# EAGLE design Central_march16 (EAGLE 7.6.0)
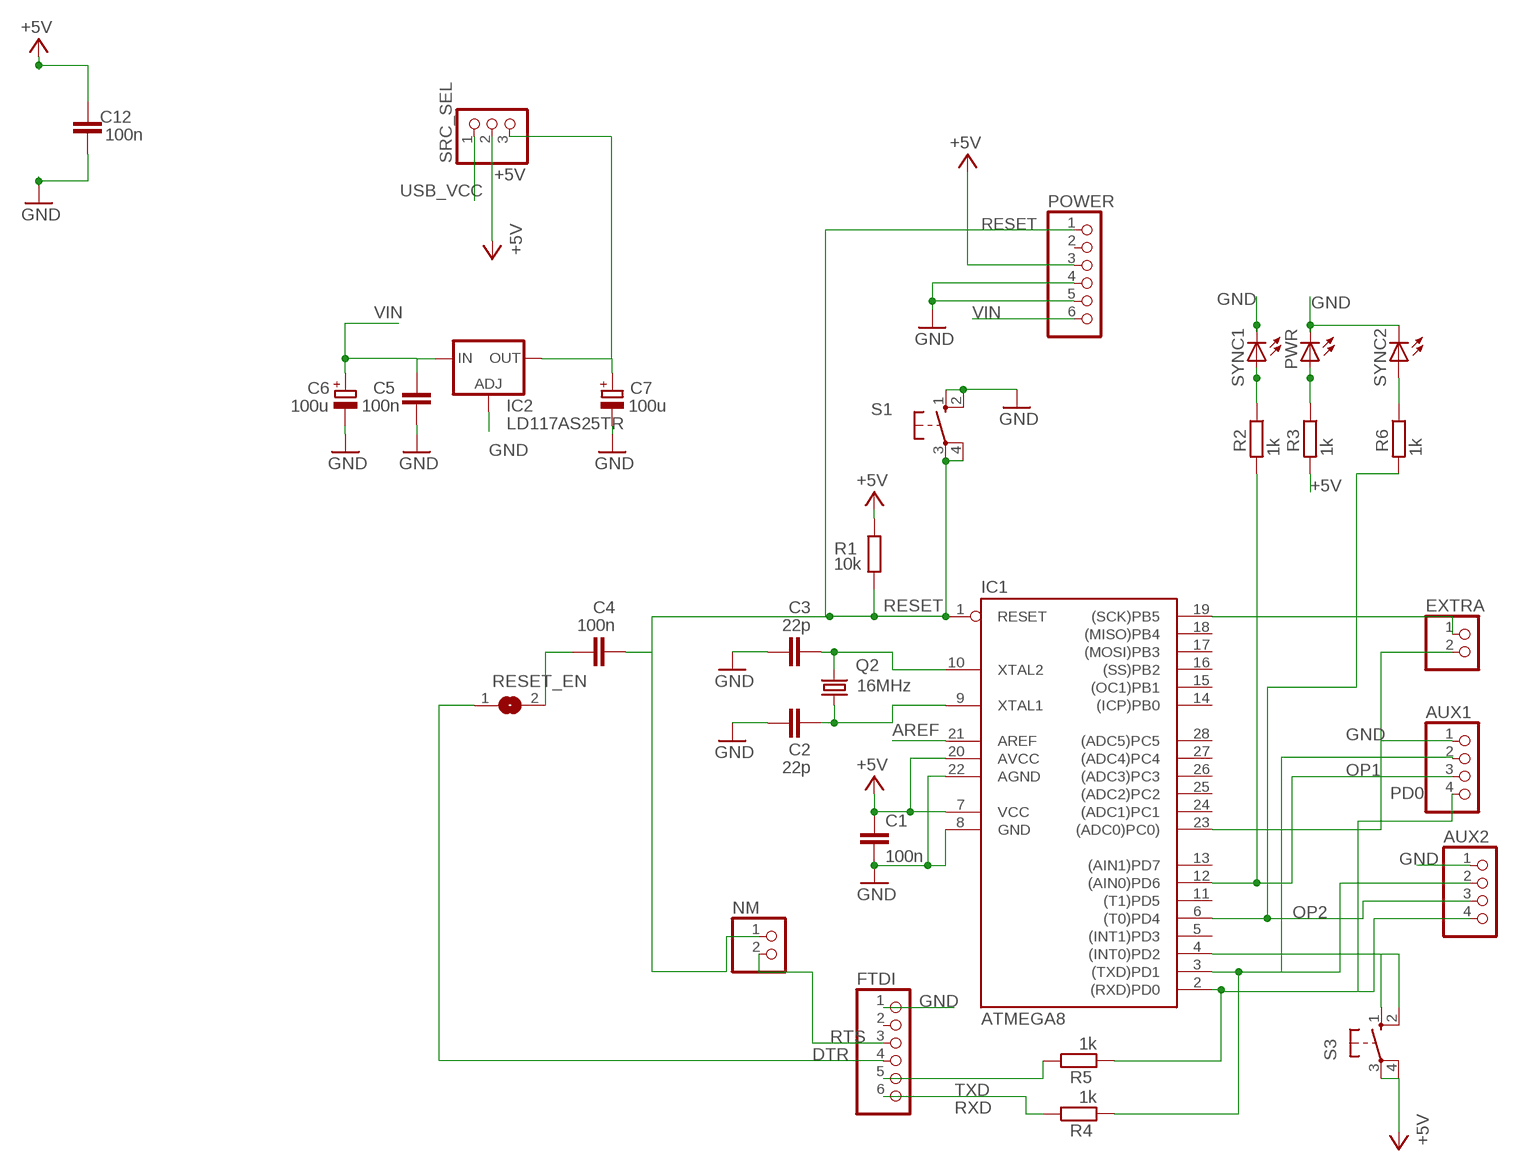
[diagram p0: schematic, sheet 1]

## Parts
AUX1  PINHD-1X4  [1X04]
AUX2  PINHD-1X4  [1X04]
C1  100n  C-EUC1206  [C1206]
C2  22p  C-EUC1206  [C1206]
C3  22p  C-EUC1206  [C1206]
C4  100n  C-EUC1206  [C1206]
C5  100n  C-EUC1206  [C1206]
C6  100u  CPOL-EUD  [PANASONIC_D]
C7  100u  CPOL-EUD  [PANASONIC_D]
C12  100n  C-EUC1206  [C1206]
EXTRA  PINHD-1X2  [1X02]
FTDI  PINHD-1X6  [1X06]
IC1  ATMEGA8  AT90S4433P  [DIL28-3]
IC2  LD117AS25TR  [SOT223]
NM  PINHD-1X2  [1X02]
POWER  PINHD-1X6  [1X06]
PWR  LEDCHIPLED_1206  [CHIPLED_1206]
Q2  16MHz  CRYTALHC49S  [HC49/S]
R1  10k  R-EU_R1206  [R1206]
R2  1k  R-EU_R1206  [R1206]
R3  1k  R-EU_R1206  [R1206]
R4  1k  R-EU_R1206  [R1206]
R5  1k  R-EU_R1206  [R1206]
R6  1k  R-EU_R1206  [R1206]
RESET_EN  SJ  [SJ]
S1  10-XX  [B3F-10XX]
S3  10-XX  [B3F-10XX]
SRC_SEL  PINHD-1X3  [1X03]
SYNC1  LEDCHIPLED_1206  [CHIPLED_1206]
SYNC2  LEDCHIPLED_1206  [CHIPLED_1206]

## Nets
+5V [usbvcc]: C1.1 C12.2 IC1.7(VCC) IC1.20(AVCC) POWER.3 R1.2 R3.2 S3.3(P) S3.4(P1) SRC_SEL.2
AREF [aref]: IC1.21(AREF)
DTR: FTDI.4 RESET_EN.1
GND [gnd]: AUX1.1 AUX2.1 C1.2 C2.1 C3.1 C5.1 C6.- C7.- C12.1 FTDI.1 IC1.8(GND) IC1.22(AGND) IC2.1(ADJ) POWER.4 POWER.5 PWR.C S1.1(S) S1.2(S1) SYNC1.C SYNC2.C
N$1: R6.1 SYNC2.A
N$2: EXTRA.2 IC1.23((ADC0)PC0))
N$3: R2.1 SYNC1.A
N$4: PWR.A R3.1
N$5: IC1.4((INT0)PD2) S3.1(S) S3.2(S1)
N$6: C2.2 IC1.9(XTAL1) Q2.1
N$7: C3.2 IC1.10(XTAL2) Q2.2
N$8: C4.1 RESET_EN.2
N$9: EXTRA.1 IC1.19((SCK)PB5)
N$10: AUX1.2 AUX2.2 IC1.3((TXD)PD1) R4.2
OP1: AUX1.3 IC1.12((AIN0)PD6) R2.2
OP2: AUX2.3 IC1.6((T0)PD4) R6.2
PD0: AUX1.4 AUX2.4 IC1.2((RXD)PD0) R5.2
RESET: C4.2 IC1.1(RESET) NM.1 POWER.1 R1.1 S1.3(P) S1.4(P1)
RTS: FTDI.3 NM.2
RXD: FTDI.6 R4.1
TXD: FTDI.5 R5.1
USB_VCC: SRC_SEL.1
VIN [power]: C5.2 C6.+ IC2.3(IN) POWER.6
VIN_REG [usbvcc]: C7.+ IC2.4(OUT) SRC_SEL.3
Unconnected: FTDI.2 IC1.5((INT1)PD3) IC1.11((T1)PD5) IC1.13((AIN1)PD7) IC1.14((ICP)PB0) IC1.15((OC1)PB1) IC1.16((SS)PB2) IC1.17((MOSI)PB3) IC1.18((MISO)PB4) IC1.24((ADC1)PC1) IC1.25((ADC2)PC2) IC1.26((ADC3)PC3) IC1.27((ADC4)PC4) IC1.28((ADC5)PC5) POWER.2

## Library data of the parts
AUX1 AUX2 = pinhead:PINHD-1X4: PIN HEADER
C1-C5 C12 = rcl:C-EU: CAPACITOR, European symbol
C6 C7 = rcl:CPOL-EU: POLARIZED CAPACITOR, European symbol
EXTRA NM = pinhead:PINHD-1X2: PIN HEADER
FTDI POWER = pinhead:PINHD-1X6: PIN HEADER
IC1 = atmel:AT90S4433: MICROCONTROLLER 4 Kbytes FLASH 128 bytes SRAM 256 bytes EEPROM UART 6-channel 10 bit ADC
IC2 = v-reg:LD117A?*: Low drop fixed and adjustable positive voltage regulators 1 A Source: http://www.st.com/stonline/products/literature/ds/7194/ld1117axx.pdf
PWR SYNC1 SYNC2 = led:LED: LED OSRAM: - CHIPLED LG R971, LG N971, LY N971, LG Q971, LY Q971, LO R971, LY R971 LH N974, LH R974 LS Q976, LO Q976, LY Q976 LO Q996 - Hyper CHIPLED LW Q18S LB Q993, LB Q99A, LB R99A - SideLED LS A670, LO A670, LY A670, LG A670, LP A670 LB A673, LV A673, LT A673, LW A673 LH A674 LY A675 LS A676, LA A676, LO A676, LY A676, LW A676 LS A679, LY A679, LG A679 - Hyper Micro SIDELED® LS Y876, LA Y876, LO Y876, LY Y876 LT Y87S - SmartLED LW L88C, LW L88S LB L89C, LB L89S, LG L890 LS L89K, LO L89K, LY L89K LS L896, LA L896, LO L896, LY L896 - TOPLED LS T670, LO T670, LY T670, LG T670, LP T670 LSG T670, LSP T670, LSY T670, LOP T670, LYG T670 LG T671, LOG T671, LSG T671 LB T673, LV T673, LT T673, LW T673 LH T674 LS T676, LA T676, LO T676, LY T676, LB T676, LH T676, LSB T676, LW T676 LB T67C, LV T67C, LT T67C, LS T67K, LO T67K, LY T67K, LW E67C LS E67B, LA E67B, LO E67B, LY E67B, LB E67C, LV E67C, LT E67C LW T67C LS T679, LY T679, LG T679 LS T770, LO T770, LY T770, LG T770, LP T770 LB T773, LV T773, LT T773, LW T773 LH T774 LS E675, LA E675, LY E675, LS T675 LS T776, LA T776, LO T776, LY T776, LB T776 LHGB T686 LT T68C, LB T68C - Hyper Mini TOPLED® LB M676 - Mini TOPLED Santana® LG M470 LS M47K, LO M47K, LY M47K Source: http://www.osram.convergy.de LUXEON: - LUMILED® LXK2-PW12-R00, LXK2-PW12-S00, LXK2-PW14-U00, LXK2-PW14-V00 LXK2-PM12-R00, LXK2-PM12-S00, LXK2-PM14-U00 LXK2-PE12-Q00, LXK2-PE12-R00, LXK2-PE12-S00, LXK2-PE14-T00, LXK2-PE14-U00 LXK2-PB12-K00, LXK2-PB12-L00, LXK2-PB12-M00, LXK2-PB14-N00, LXK2-PB14-P00, LXK2-PB14-Q00 LXK2-PR12-L00, LXK2-PR12-M00, LXK2-PR14-Q00, LXK2-PR14-R00 LXK2-PD12-Q00, LXK2-PD12-R00, LXK2-PD12-S00 LXK2-PH12-R00, LXK2-PH12-S00 LXK2-PL12-P00, LXK2-PL12-Q00, LXK2-PL12-R00 Source: www.luxeon.com KINGBRIGHT: KA-3528ASYC Source: www.kingbright.com
Q2 = crystal:CRYTAL: CRYSTAL
R1-R6 = rcl:R-EU_: RESISTOR, European symbol
RESET_EN = jumper:SJ: SMD solder JUMPER
S1 S3 = switch-omron:10-XX: OMRON SWITCH; MPN: B3F-1000; OC_FARNELL: 176432; OC_NEWARK: 36M3542
SRC_SEL = pinhead:PINHD-1X3: PIN HEADER

## Net classes
0 default: width 0.254 mm, drill 0.305 mm, clearance 0.152 mm
1 power: width 0.61 mm, drill 0.508 mm, clearance 0.152 mm
2 gnd: width 0.305 mm, drill 0.508 mm, clearance 0.152 mm
3 usbvcc: width 0.508 mm, drill 0.508 mm, clearance 0.152 mm
4 aref: width 0.406 mm

## Board
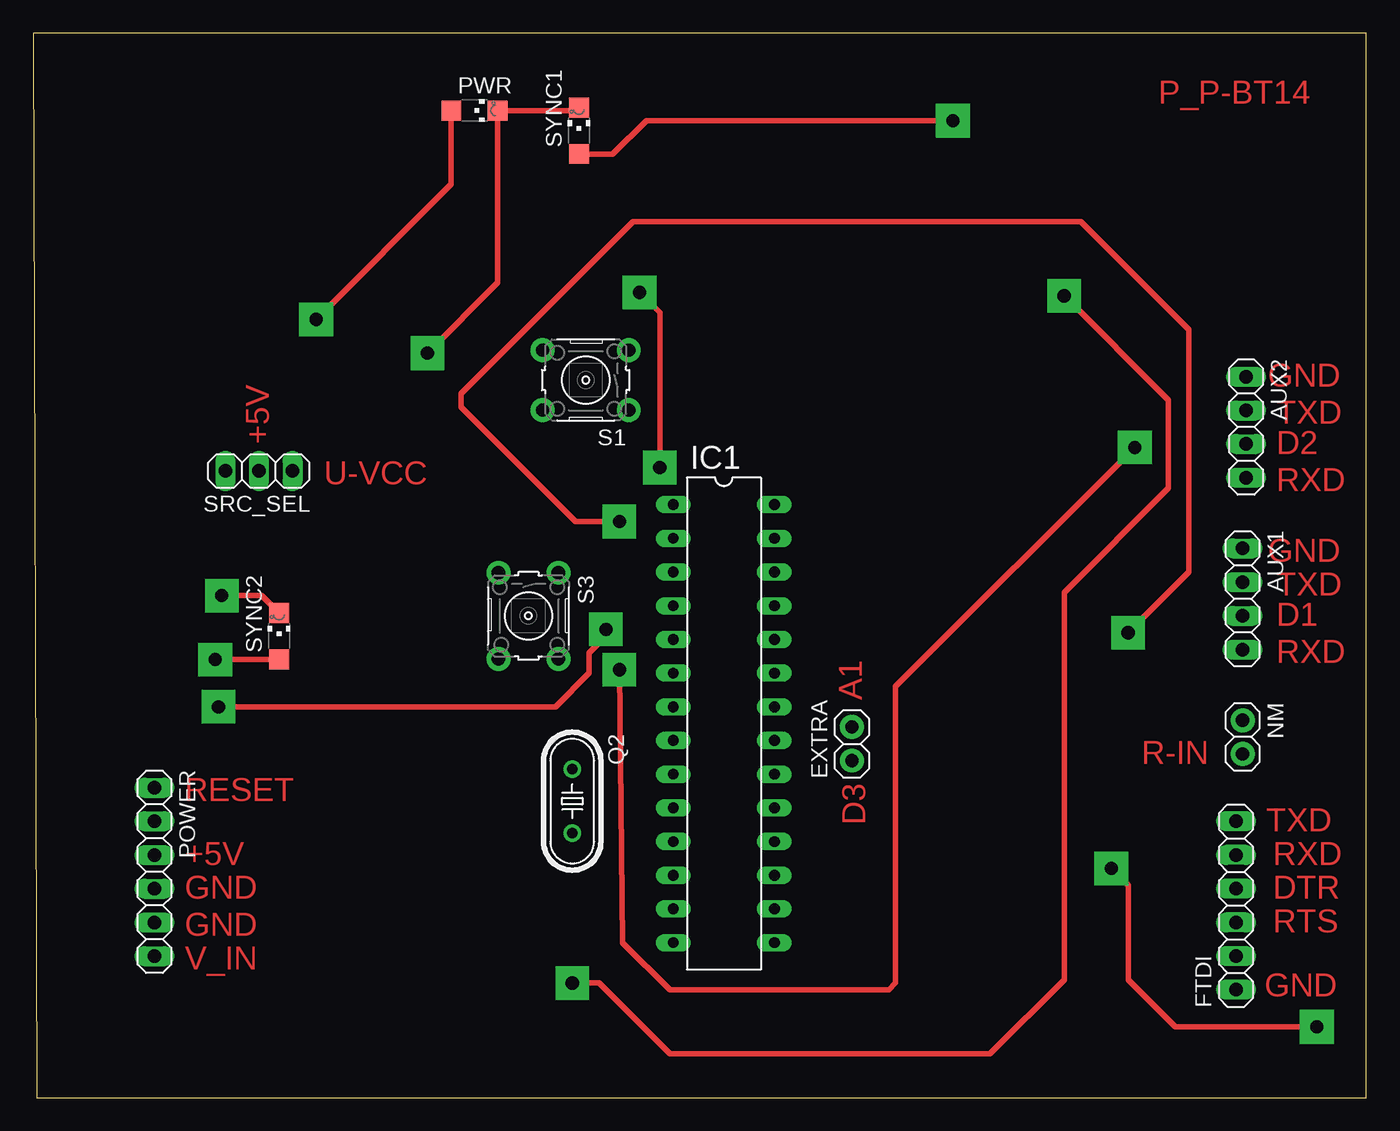
[diagram p1: board, top side]
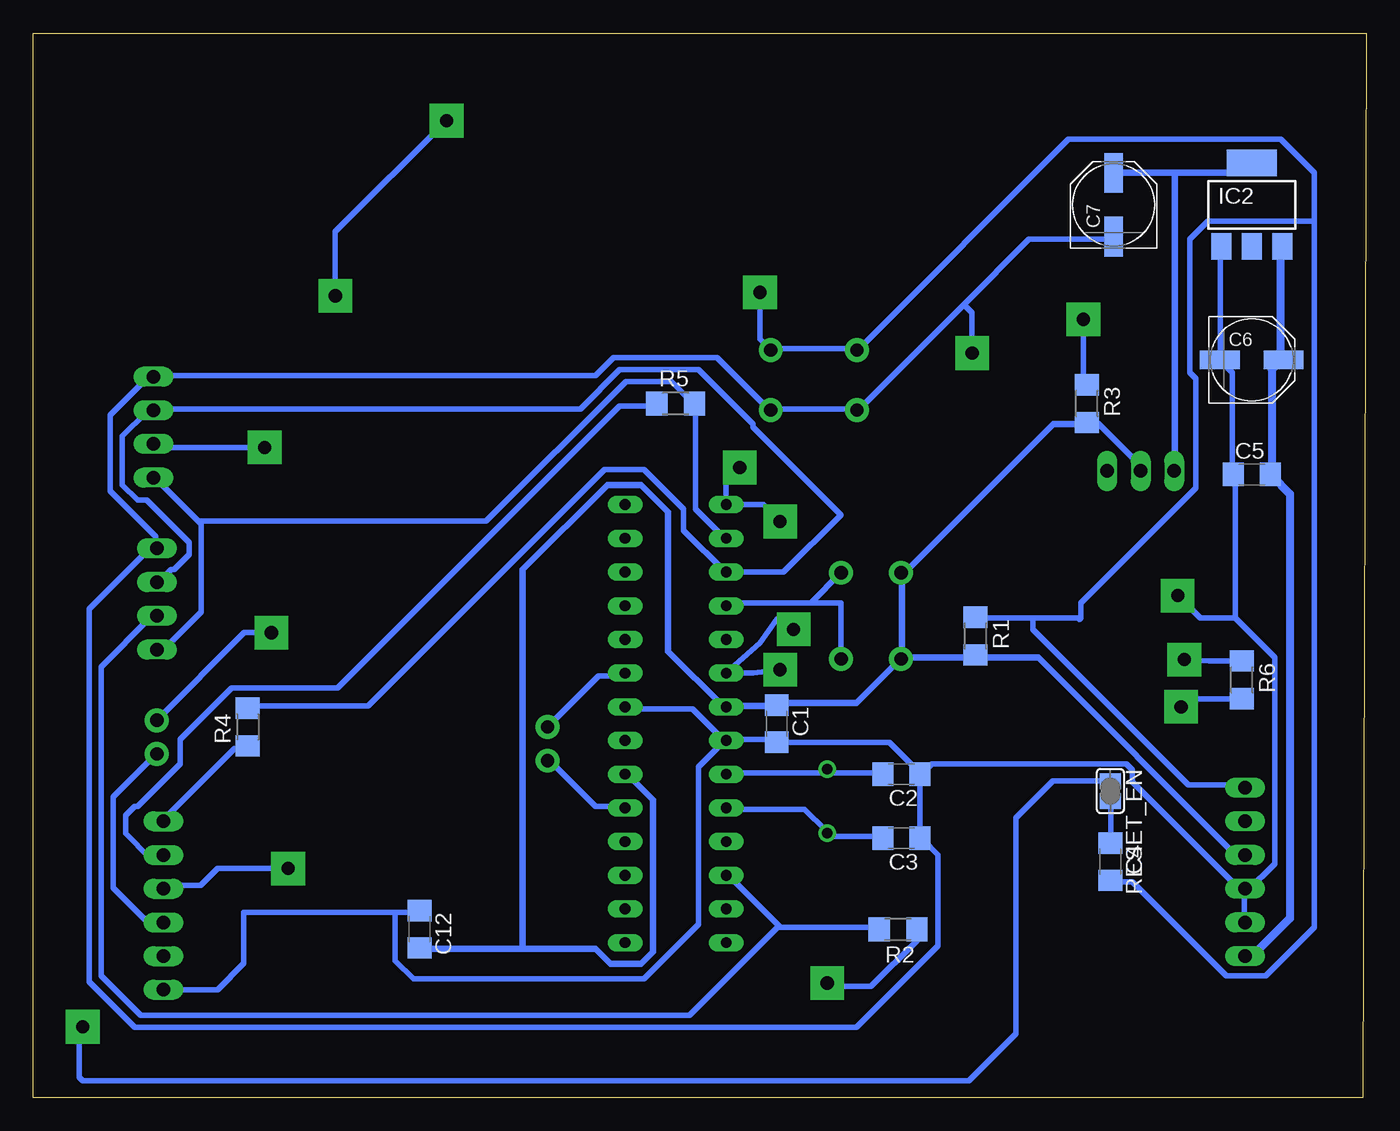
[diagram p2: board, bottom side, seen from below]

Size 100.51 x 80.25 mm. Coordinates in mm from the lower left corner, seen from the top.
Outline: 0.25,0 100.51,0 100.51,80.25 0,80.25 0.25,0
Copper layers (1*16): Top 0.035mm / dielectric 1.5mm / Bottom 0.035mm
Design rules "default *": minimum track width 16mil, minimum drill 24mil, track to track 20mil, track to pad 20mil, pad to pad 20mil, via to via 20mil, smd to smd 20mil, copper to edge 40mil, drill to drill 8mil, minimum pad ring 10mil, minimum via ring 8mil, stop-mask expansion 4mil, vias tented up to drill 0mil, thermal gap 10mil

### Footprints (pad centres in the part's own frame; a part is rotated, then mirrored left to right if it is on the bottom)
1X04 = drill 1.016 long: 1 -3.81,0; 2 -1.27,0; 3 1.27,0; 4 3.81,0
C1206 = smd 1.6 x 1.8: 1 -1.4,0; 2 1.4,0
PANASONIC_D = smd 3 x 1.4: + 2.4,0; - -2.4,0
1X02 = drill 1 pad 1.8: 1 -1.27,0; 2 1.27,0
1X06 = drill 1.016 long: 1 -6.35,0; 2 -3.81,0; 3 -1.27,0; 4 1.27,0; 5 3.81,0; 6 6.35,0
DIL28-3 = drill 0.813 long: 1 -16.51,-3.81; 2 -13.97,-3.81; 3 -11.43,-3.81; 4 -8.89,-3.81; 5 -6.35,-3.81; 6 -3.81,-3.81; 7 -1.27,-3.81; 8 1.27,-3.81; 9 3.81,-3.81; 10 6.35,-3.81; 11 8.89,-3.81; 12 11.43,-3.81; 13 13.97,-3.81; 14 16.51,-3.81; 15 16.51,3.81; 16 13.97,3.81; 17 11.43,3.81; 18 8.89,3.81; 19 6.35,3.81; 20 3.81,3.81; 21 1.27,3.81; 22 -1.27,3.81; 23 -3.81,3.81; 24 -6.35,3.81; 25 -8.89,3.81; 26 -11.43,3.81; 27 -13.97,3.81; 28 -16.51,3.81
SOT223 = smd 1.5 x 2: 1 -2.3,-3.15; 2 0,-3.15; 3 2.3,-3.15 | smd 3.8 x 2: 4 0,3.15
CHIPLED_1206 = smd 1.5 x 1.5: A 0,-1.75; C 0,1.75
HC49/S = drill 0.813: 1 -2.413,0; 2 2.413,0
R1206 = smd 1.6 x 1.803: 1 -1.422,0; 2 1.422,0
SJ = smd 1.168 x 1.6: 1 -0.762,0; 2 0.762,0
B3F-10XX = drill 1 pad 1.8: 1 -3.251,2.261; 2 3.251,2.261; 3 -3.251,-2.261; 4 3.251,-2.261
1X03 = drill 1.016 long: 1 -2.54,0; 2 0,0; 3 2.54,0

### Placement (x,y rotation side)
AUX1  91.19,37.59 270 top
AUX2  91.44,50.55 270 top
C1  44.45,28.19 270 bottom
C2  35.05,24.38 180 bottom
C3  35.05,19.56 180 bottom
C4  19.3,17.78 270 bottom
C5  8.64,46.99 0 bottom
C6  8.64,55.63 0 bottom
C7  19.05,67.31 90 bottom
C12  71.37,12.7 270 bottom
EXTRA  61.72,26.67 90 top
FTDI  90.68,14.48 90 top
IC1  52.07,28.19 270 top
IC2  8.64,67.31 0 bottom
NM  91.19,27.18 270 top
POWER  9.14,17.02 270 top
PWR  33.27,74.42 270 top
Q2  40.64,22.35 270 top
R1  29.46,34.8 270 bottom
R2  35.31,12.7 180 bottom
R3  21.08,52.32 270 bottom
R4  84.33,27.94 90 bottom
R5  52.07,52.32 0 bottom
R6  9.4,31.5 270 bottom
RESET_EN  19.3,23.11 270 bottom
S1  41.66,54.1 180 top
S3  37.34,36.32 270 top
SRC_SEL  17.02,47.24 180 top
SYNC1  41.15,72.9 0 top
SYNC2  18.54,34.8 0 top

### Tracks (layer width: path | path; a pad name or v marks a point on that pad's centre or on a via)
+5V
  Bottom 0.508: 63.6,11.23 58.12,11.23 56.97,10.08 54.69,10.08 53.77,11 53.77,22.43 55.83,24.49 IC1.20 | 63.6,11.23 71.37,11.23 C12.2 | SRC_SEL.2 17.2,47.35 17.2,47.8 20.17,50.77 21.08,50.77 R3.2 21.31,50.77 23.6,50.77 34.8,39.57 S3.3 35.03,39.57 35.03,33.4 S3.4 | S3.4 35.03,33.17 29.54,33.17 R1.2 29.31,33.17 24.74,33.17 9.88,18.31 9.2,18.31 POWER.3 | S3.4 35.26,32.94 38.46,29.74 44.4,29.74 C1.1 44.63,29.52 48.06,29.52 IC1.7 48.51,29.52 52.63,33.63 52.63,44.14 54.69,46.2 57.2,46.2 63.6,39.8 63.6,11.23
DTR  (via drill 0.99 pad 2.54)
  Top 0.406: v96.77,5.33 86.11,5.33 82.55,8.89 82.55,16 v81.28,17.27
  Bottom 0.406: RESET_EN.1 23.62,23.88 26.42,21.08 26.42,4.83 29.97,1.27 96.77,1.27 97.03,1.52 97.03,5.08 v96.77,5.33 | v81.28,17.27 86.61,17.27 87.88,16 90.68,16 FTDI.4
GND  (via drill 0.99 pad 2.54)
  Top 0.406: SYNC1.C 40.92,74.42 PWR.C 35.02,61.44 v29.72,56.13 | v14.22,37.85 17.24,37.85 SYNC2.C
  Bottom 0.406: 91.26,41.4 91.26,42.32 94.69,45.74 94.69,51.46 91.95,54.2 91.49,54.2 AUX2.1 91.26,54.43 58.12,54.43 56.74,55.8 48.97,55.8 45.09,51.92 S1.1 44.86,51.92 38.46,51.92 S1.2 38.23,51.92 30.34,59.8 | 30.34,59.8 25.43,64.72 19.25,64.72 C7.- | 73.2,13.97 84.63,13.97 84.63,10.11 86.61,8.13 FTDI.1 91.03,8.03 90.58,8.03 | 73.2,13.97 71.37,13.97 C12.1 | IC2.1 11.02,64.03 11.02,55.8 C6.- 11.02,55.57 10.11,54.66 10.11,47.12 C5.1 9.88,46.89 9.88,36.14 | POWER.5 9.2,13.28 9.2,15.57 POWER.4 | C2.1 33.66,24.26 33.66,19.69 C3.1 33.43,19.46 32.28,18.31 32.28,11.46 38.46,5.28 92.86,5.28 96.29,8.71 96.29,36.83 91.72,41.4 91.26,41.4 | IC1.8 48.06,27 44.63,27 C1.2 44.4,26.77 35.94,26.77 33.66,24.49 C2.1 | IC1.22 55.83,29.29 50.8,29.29 48.29,26.77 IC1.8 | POWER.4 9.2,15.8 9.65,15.8 17.65,23.8 17.65,24.71 18.11,25.17 32.74,25.17 33.43,24.49 C2.1 | 9.88,36.14 6.91,33.17 6.91,17.63 8.97,15.57 POWER.4 | 73.2,13.97 73.2,10.31 71.83,8.94 54.46,8.94 50.34,13.06 50.34,24.94 48.51,26.77 IC1.8 | 91.26,41.4 AUX1.1 | v29.72,56.13 29.72,59.18 30.34,59.8 | 9.88,36.14 12.52,36.14 v14.22,37.85
N$1  (via drill 0.99 pad 2.54)
  Top 0.406: v13.72,33.02 18.51,33.02 SYNC2.A
  Bottom 0.406: R6.1 11.84,32.92 v13.72,33.02
N$2
  Bottom 0.406: IC1.23 56.06,31.8 57.89,31.8 61.54,28.14 EXTRA.2
N$3  (via drill 0.99 pad 2.54)
  Top 0.406: v40.64,8.64 42.67,8.64 48.01,3.3 72.14,3.3 77.72,8.89 77.72,38.1 85.6,45.97 85.6,52.58 v77.72,60.45 | v69.34,73.66 46.23,73.66 43.69,71.12 41.18,71.12 SYNC1.A
  Bottom 0.406: R2.1 33.88,11.84 37.34,8.38 40.39,8.38 v40.64,8.64 | v77.72,60.45 77.72,65.28 v69.34,73.66
N$4  (via drill 0.99 pad 2.54)
  Top 0.406: PWR.A 31.52,68.86 v21.34,58.67
  Bottom 0.406: v21.34,58.67 21.34,54 R3.1
N$5
  Bottom 0.406: 41.89,37.29 42.16,37.29 48.06,37.29 IC1.4 | S3.1 41.89,37.29 | S3.2 39.6,37.29 41.89,37.29
N$6
  Bottom 0.406: C2.2 36.63,24.49 40.28,24.49 40.51,24.71 Q2.1 40.51,24.49 48.06,24.49 IC1.9
N$7
  Bottom 0.406: C3.2 36.63,19.69 40.28,19.69 40.51,19.91 Q2.2 40.74,20.14 42.34,21.74 48.06,21.74 IC1.10
N$8
  Bottom 0.406: RESET_EN.2 19.25,22.2 19.25,19.23 C4.1
N$9
  Bottom 0.406: IC1.19 56.06,21.97 58.12,21.97 61.54,25.4 EXTRA.1
N$10
  Bottom 0.406: AUX1.2 91.03,38.89 90.12,39.8 89.89,39.8 88.75,40.95 88.75,41.86 91.95,45.06 92.63,45.06 93.78,46.2 93.78,49.86 91.95,51.69 91.49,51.69 AUX2.2 91.26,51.92 59.26,51.92 56.29,54.89 50.34,54.89 46.23,50.77 46.23,50.55 39.62,43.94 43.94,39.62 IC1.3 | R4.2 84.18,29.52 75.26,29.52 57.43,47.35 54.46,47.35 51.49,44.37 51.49,42.77 48.29,39.57 IC1.3 | 48.06,39.57 IC1.3
OP1
  Bottom 0.406: 44.29,12.94 48.06,16.71 IC1.12 | 44.29,12.94 44.17,12.83 36.86,12.83 R2.2 | 44.29,12.94 51.03,6.2 92.41,6.2 95.38,9.17 95.38,32.49 91.72,36.14 91.26,36.14 AUX1.3
OP2  (via drill 0.99 pad 2.54)
  Top 0.406: v13.97,29.46 39.37,29.46 41.91,32 41.91,33.53 43.18,34.8 v43.18,35.31 | v44.2,32.26 44.45,11.68 48.01,8.13 64.52,8.13 65.02,8.64 65.02,30.99 v83.06,49.02
  Bottom 0.406: R6.2 13.82,30.07 v13.97,29.46 | v44.2,32.26 46.23,32 IC1.6 45.72,34.29 44.45,36.07 43.94,36.07 v43.18,35.31 | v83.06,49.02 91.19,49.02 AUX2.3
PD0
  Bottom 0.406: IC1.2 48.29,42.09 50.57,44.37 50.57,52.15 R5.2 50.8,52.38 52.4,53.97 55.83,53.97 66.34,43.46 87.83,43.46 87.95,43.34 | 87.95,43.34 91.26,46.66 AUX2.4 | 87.95,43.34 87.83,43.23 87.83,36.6 90.58,33.86 91.03,33.86 AUX1.4
RESET  (via drill 0.99 pad 2.54)
  Top 0.406: v47.24,47.5 47.24,59.18 v45.72,60.71 | v44.2,43.43 40.89,43.43 32.26,52.07 32.26,53.09 45.21,66.04 78.99,66.04 87.12,57.91 87.12,39.62 v82.55,35.05
  Bottom 0.406: 25.15,36.14 21.77,36.14 21.65,36.03 21.54,36.14 21.54,37.29 12.85,45.97 12.85,54.2 13.31,54.66 13.31,64.72 11.94,66.09 3.94,66.09 | 25.15,36.14 29.31,36.14 R1.1 | POWER.1 9.2,23.57 13.41,23.57 25.15,35.31 25.15,36.14 | 3.94,66.09 3.94,69.75 6.45,72.26 22.45,72.26 38.23,56.49 S1.4 38.46,56.49 44.86,56.49 S1.3 45.72,57.17 v45.72,60.71 | 3.94,66.09 3.94,12.83 7.59,9.17 10.57,9.17 17.65,16.26 19.25,16.26 C4.2 | v47.24,47.5 48.26,46.48 IC1.1 45.47,44.7 v44.2,43.43 | v82.55,35.05 84.58,35.05 NM.1
RTS
  Bottom 0.406: FTDI.3 91.26,13.06 91.72,13.06 94.46,15.8 94.46,22.66 91.26,25.86 NM.2
RXD
  Bottom 0.406: R4.1 84.4,26.31 85.32,26.31 91.03,20.6 FTDI.6
TXD
  Bottom 0.406: R5.1 53.54,52.15 56.29,52.15 77.55,30.89 85.55,30.89 89.43,27 89.43,25.17 92.63,21.97 92.86,21.97 93.55,21.29 93.55,19.91 91.72,18.09 91.26,18.09 FTDI.5
VIN
  Bottom 0.61: IC2.3 6.45,64.03 6.45,55.8 C6.+ 6.45,55.57 7.14,54.89 7.14,47.12 C5.2 7.14,46.89 5.77,45.52 5.77,13.51 8.51,10.77 8.97,10.77 POWER.6
VIN_REG
  Bottom 0.508: 14.45,69.75 9.42,69.75 8.74,70.43 IC2.4 | 14.45,69.75 19.02,69.75 C7.+ | 14.45,69.75 14.45,47.35 SRC_SEL.3

### Text on the board
Top: P_P-BT14 | GND | TXD | +5V | U-VCC | D2 | RXD | GND | TXD | D1 | RXD | A1 | R-IN | RESET | D3 | TXD | +5V | RXD | GND | DTR | GND | RTS | V_IN | GND